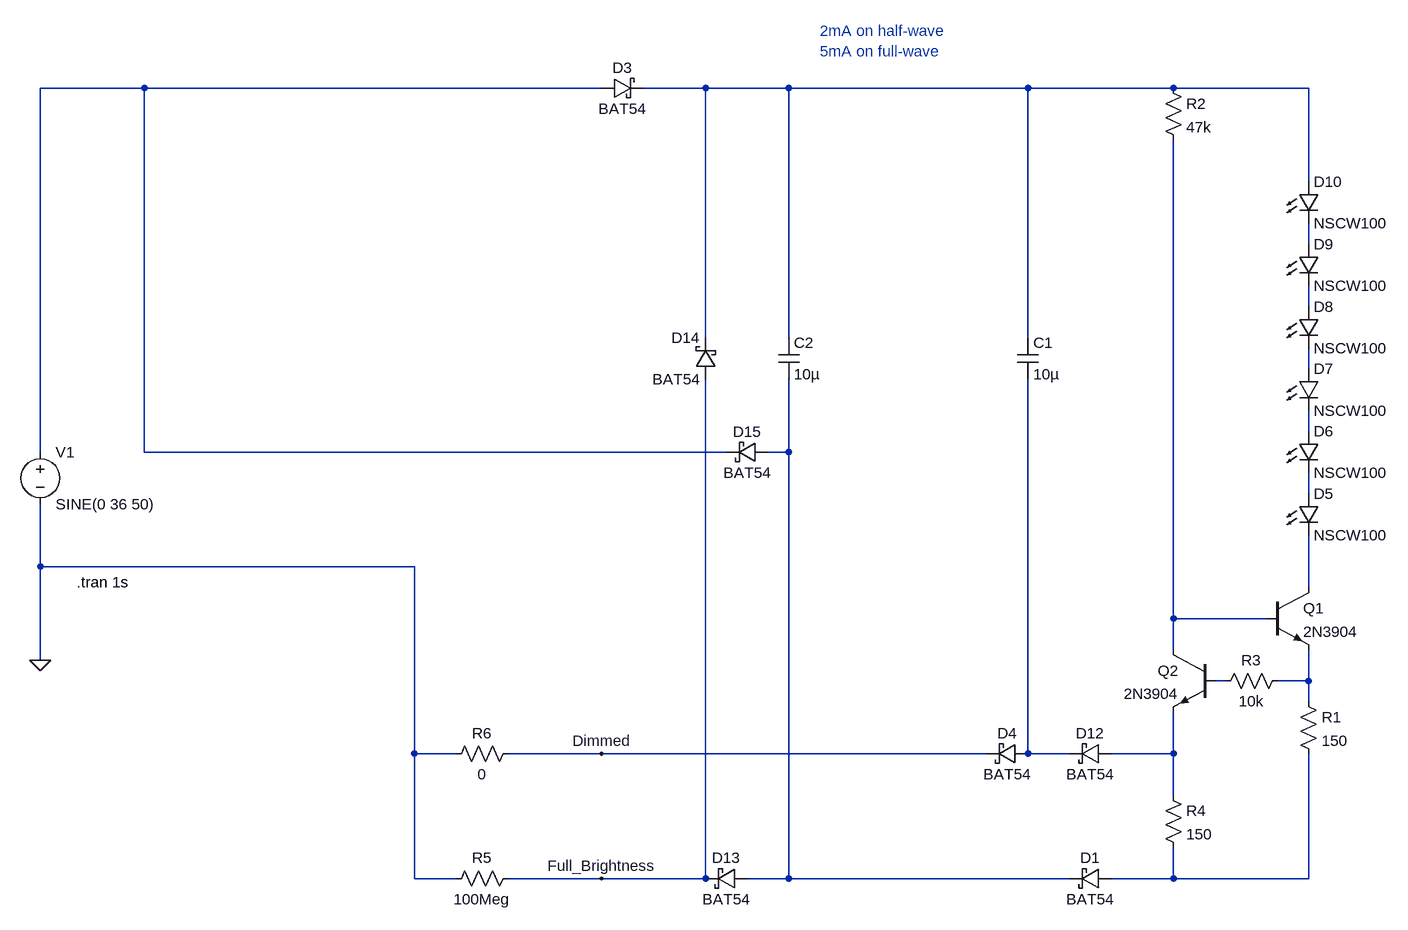
[diagram p0: schematic full_wave_with_dimming.asc]
full_wave_with_dimming.asc, the LTspice schematic file:
Version 4
SHEET 1 1128 680
WIRE -1664 -976 -1824 -976
WIRE -960 -976 -1664 -976
WIRE -800 -976 -896 -976
WIRE -672 -976 -800 -976
WIRE -304 -976 -672 -976
WIRE -80 -976 -304 -976
WIRE 128 -976 -80 -976
WIRE 128 -832 128 -976
WIRE 128 -736 128 -768
WIRE 128 -640 128 -672
WIRE -800 -592 -800 -976
WIRE -672 -592 -672 -976
WIRE -304 -592 -304 -976
WIRE 128 -544 128 -576
WIRE 128 -448 128 -480
WIRE -1824 -416 -1824 -976
WIRE -1664 -416 -1664 -976
WIRE -768 -416 -1664 -416
WIRE -672 -416 -672 -528
WIRE -672 -416 -704 -416
WIRE 128 -352 128 -384
WIRE -1824 -240 -1824 -336
WIRE -1248 -240 -1824 -240
WIRE 128 -208 128 -288
WIRE -80 -160 -80 -896
WIRE 64 -160 -80 -160
WIRE -80 -112 -80 -160
WIRE -1824 -96 -1824 -240
WIRE 0 -64 -16 -64
WIRE 128 -64 128 -112
WIRE 128 -64 80 -64
WIRE 128 -32 128 -64
WIRE -1248 48 -1248 -240
WIRE -1184 48 -1248 48
WIRE -960 48 -1104 48
WIRE -368 48 -960 48
WIRE -304 48 -304 -528
WIRE -240 48 -304 48
WIRE -80 48 -80 -16
WIRE -80 48 -176 48
WIRE -80 112 -80 48
WIRE -1248 240 -1248 48
WIRE -1184 240 -1248 240
WIRE -960 240 -1104 240
WIRE -800 240 -800 -528
WIRE -800 240 -960 240
WIRE -672 240 -672 -416
WIRE -672 240 -736 240
WIRE -240 240 -672 240
WIRE -80 240 -80 192
WIRE -80 240 -176 240
WIRE 128 240 128 48
WIRE 128 240 -80 240
FLAG -1824 -96 0
FLAG -960 240 Full_Brightness
FLAG -960 48 Dimmed
SYMBOL voltage -1824 -432 R0
WINDOW 123 0 0 Left 0
WINDOW 39 0 0 Left 0
SYMATTR InstName V1
SYMATTR Value SINE(0 36 50)
SYMBOL schottky -960 -960 R270
WINDOW 0 32 32 VTop 2
WINDOW 3 0 32 VBottom 2
SYMATTR InstName D3
SYMATTR Value BAT54
SYMATTR Description Diode
SYMATTR Type diode
SYMBOL schottky -304 32 R90
WINDOW 0 0 32 VBottom 2
WINDOW 3 32 32 VTop 2
SYMATTR InstName D4
SYMATTR Value BAT54
SYMATTR Description Diode
SYMATTR Type diode
SYMBOL LED 112 -352 R0
SYMATTR InstName D5
SYMATTR Value NSCW100
SYMATTR Description Diode
SYMATTR Type diode
SYMBOL cap -320 -592 R0
SYMATTR InstName C1
SYMATTR Value 10µ
SYMBOL npn 64 -208 R0
SYMATTR InstName Q1
SYMATTR Value 2N3904
SYMBOL res 112 -48 R0
SYMATTR InstName R1
SYMATTR Value 150
SYMBOL res -96 -992 R0
SYMATTR InstName R2
SYMATTR Value 47k
SYMBOL npn -16 -112 M0
SYMATTR InstName Q2
SYMATTR Value 2N3904
SYMBOL res 96 -80 R90
WINDOW 0 0 56 VBottom 2
WINDOW 3 32 56 VTop 2
SYMATTR InstName R3
SYMATTR Value 10k
SYMBOL LED 112 -448 R0
SYMATTR InstName D6
SYMATTR Value NSCW100
SYMATTR Description Diode
SYMATTR Type diode
SYMBOL LED 112 -544 R0
SYMATTR InstName D7
SYMATTR Value NSCW100
SYMATTR Description Diode
SYMATTR Type diode
SYMBOL LED 112 -640 R0
SYMATTR InstName D8
SYMATTR Value NSCW100
SYMATTR Description Diode
SYMATTR Type diode
SYMBOL LED 112 -736 R0
SYMATTR InstName D9
SYMATTR Value NSCW100
SYMATTR Description Diode
SYMATTR Type diode
SYMBOL LED 112 -832 R0
SYMATTR InstName D10
SYMATTR Value NSCW100
SYMATTR Description Diode
SYMATTR Type diode
SYMBOL res -96 96 R0
SYMATTR InstName R4
SYMATTR Value 150
SYMBOL schottky -176 32 R90
WINDOW 0 0 32 VBottom 2
WINDOW 3 32 32 VTop 2
SYMATTR InstName D12
SYMATTR Value BAT54
SYMATTR Description Diode
SYMATTR Type diode
SYMBOL cap -688 -592 R0
SYMATTR InstName C2
SYMATTR Value 10µ
SYMBOL schottky -736 224 R90
WINDOW 0 0 32 VBottom 2
WINDOW 3 32 32 VTop 2
SYMATTR InstName D13
SYMATTR Value BAT54
SYMATTR Description Diode
SYMATTR Type diode
SYMBOL res -1088 224 R90
WINDOW 0 0 56 VBottom 2
WINDOW 3 32 56 VTop 2
SYMATTR InstName R5
SYMATTR Value 100Meg
SYMBOL res -1088 32 R90
WINDOW 0 0 56 VBottom 2
WINDOW 3 32 56 VTop 2
SYMATTR InstName R6
SYMATTR Value 0
SYMBOL schottky -784 -528 R180
WINDOW 0 24 64 Left 2
WINDOW 3 24 0 Left 2
SYMATTR InstName D14
SYMATTR Value BAT54
SYMATTR Description Diode
SYMATTR Type diode
SYMBOL schottky -704 -432 R90
WINDOW 0 0 32 VBottom 2
WINDOW 3 32 32 VTop 2
SYMATTR InstName D15
SYMATTR Value BAT54
SYMATTR Description Diode
SYMATTR Type diode
SYMBOL schottky -176 224 R90
WINDOW 0 0 32 VBottom 2
WINDOW 3 32 32 VTop 2
SYMATTR InstName D1
SYMATTR Value BAT54
SYMATTR Description Diode
SYMATTR Type diode
TEXT -1768 -216 Left 2 !.tran 1s
TEXT -624 -1064 Left 2 ;2mA on half-wave\n5mA on full-wave

The netlist it stands for:
* full_wave_with_dimming.asc
V1 N001 0 SINE(0 36 50)
D3 N001 N002 BAT54
D4 N013 Dimmed BAT54
D5 N008 N009 NSCW100
C1 N002 N013 10µ
Q1 N009 N010 N012 0 2N3904
R1 N012 N015 150
R2 N002 N010 47k
Q2 N010 N011 N014 0 2N3904
R3 N012 N011 10k
D6 N006 N008 NSCW100
D7 N005 N006 NSCW100
D8 N004 N005 NSCW100
D9 N003 N004 NSCW100
D10 N002 N003 NSCW100
R4 N014 N015 150
D12 N014 N013 BAT54
C2 N002 N007 10µ
D13 N007 Full_Brightness BAT54
R5 Full_Brightness 0 100Meg
R6 Dimmed 0 0
D14 Full_Brightness N002 BAT54
D15 N007 N001 BAT54
D1 N015 N007 BAT54
.model D D
.lib standard.dio
.model NPN NPN
.model PNP PNP
.lib standard.bjt
.tran 1s
* 2mA on half-wave
* 5mA on full-wave
.backanno
.end